# Altium schematic sheet USART.SchDoc
size A4; SheetNumber: 8; SheetTotal: 8
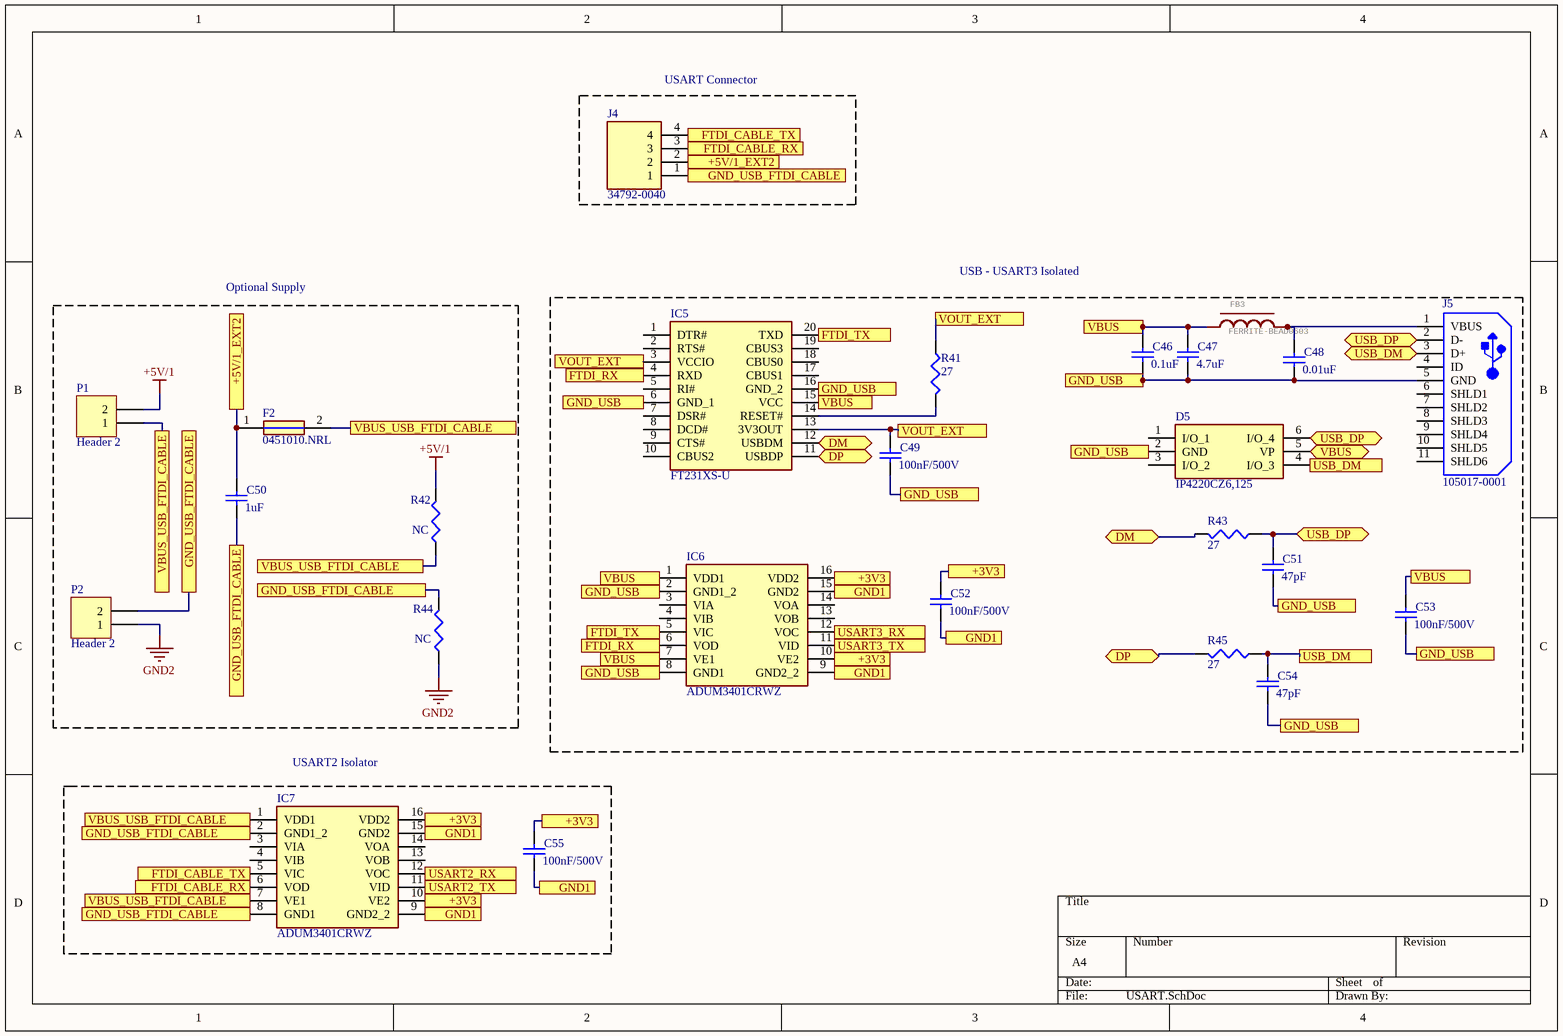
[diagram p0: USART.SchDoc]

## Parts
C46  value 0.1uF  [1608[0603]]  (hidden comment: Cap Semi)
C47  value 4.7uF  [C1206]  (hidden comment: Cap Semi)
C48  value 0.01uF  [1608[0603]]  (hidden comment: Cap Semi)
C49  value 100nF/500V  [1608[0603]]  (hidden comment: Cap Semi)
C50  value 1uF  [1608[0603]]  (hidden comment: Cap Semi)
C51  value 47pF  [1608[0603]]  (hidden comment: Cap Semi)
C52  value 100nF/500V  [1608[0603]]  (hidden comment: Cap Semi)
C53  value 100nF/500V  [1608[0603]]  (hidden comment: Cap Semi)
C54  value 47pF  [1608[0603]]  (hidden comment: Cap Semi)
C55  value 100nF/500V  [1608[0603]]  (hidden comment: Cap Semi)
D5  IP4220CZ6,125  [SOT95P275X110-6N]
F2  0451010.NRL  [FUSC6127X294N]
FB3  FERRITE-BEAD0603  [0603_INCH]
IC5  FT231XS-U  [SOP64P599X175-20N]
IC6  ADUM3401CRWZ  [SOIC127P1032X265-16N]
IC7  ADUM3401CRWZ  [SOIC127P1032X265-16N]
J4  34792-0040  [347920040]
J5  105017-0001  [USB-MICRO-B_V]
P1  Header 2  [HDR1X2]
P2  Header 2  [HDR1X2]
R41  value 27  [J1-0603]  (hidden comment: Res3)
R42  value NC  [J1-0603]  (hidden comment: Res3)
R43  value 27  [J1-0603]  (hidden comment: Res3)
R44  value NC  [J1-0603]  (hidden comment: Res3)
R45  value 27  [J1-0603]  (hidden comment: Res3)

## Blocks framed on the sheet
USART Connector: J4
USB - USART3 Isolated: C46-C49 C51-C54 D5 FB3 IC5 IC6 J5 R41 R43 R45
Optional Supply: C50 F2 P1 P2 R42 R44
USART2 Isolator: C55 IC7

## Ports
+3V3, +5V/1_EXT2, DM (bidir), DP (bidir), FTDI_CABLE_RX (in), FTDI_CABLE_RX (out), FTDI_CABLE_TX (in), FTDI_CABLE_TX (out), FTDI_RX (in), FTDI_RX (out), FTDI_TX (in), FTDI_TX (out), GND1, GND_USB, GND_USB_FTDI_CABLE, USART2_RX (out), USART2_TX (in), USART3_RX (out), USART3_TX (in), USB_DM, USB_DM (bidir), USB_DP (bidir), VBUS, VBUS (bidir), VBUS_USB_FTDI_CABLE, VOUT_EXT

## Nets
+5V/1: P1.2 R42.2
GND2: P2.1 R44.1
+3V3: C52.2 C55.2 IC6.10(VE2) IC6.16(VDD2) IC7.10(VE2) IC7.16(VDD2) ; port +3V3
+5V/1_EXT2: C50.2 F2.1 J4.2 ; port +5V/1_EXT2
DM: IC5.12(USBDM) R43.2 ; port DM
DP: IC5.11(USBDP) R45.2 ; port DP
FTDI_CABLE_RX: IC7.6(VOD) J4.3 ; port FTDI_CABLE_RX
FTDI_CABLE_TX: IC7.5(VIC) J4.4 ; port FTDI_CABLE_TX
FTDI_RX: IC5.4(RXD) IC6.6(VOD) ; port FTDI_RX
FTDI_TX: IC5.20(TXD) IC6.5(VIC) ; port FTDI_TX
GND1: C52.1 C55.1 IC6.9(GND2_2) IC6.15(GND2) IC7.9(GND2_2) IC7.15(GND2) ; port GND1
GND_USB: C46.1 C47.1 C48.1 C49.1 C51.1 C53.1 C54.1 D5.2(GND) IC5.6(GND_1) IC5.16(GND_2) IC6.2(GND1_2) IC6.8(GND1) J5.5(GND) ; port GND_USB
GND_USB_FTDI_CABLE: C50.1 IC7.2(GND1_2) IC7.8(GND1) J4.1 P2.2 R44.2 ; port GND_USB_FTDI_CABLE
USART2_RX: IC7.12(VOC) ; port USART2_RX
USART2_TX: IC7.11(VID) ; port USART2_TX
USART3_RX: IC6.12(VOC) ; port USART3_RX
USART3_TX: IC6.11(VID) ; port USART3_TX
USB_DM: C54.2 D5.4(I/O_3) J5.3(D+) R45.1 ; port USB_DM
USB_DP: C51.2 D5.6(I/O_4) J5.2(D-) R43.1 ; port USB_DP
VBUS: C46.2 C47.2 C53.2 D5.5(VP) FB3.1 IC5.15(VCC) IC6.1(VDD1) IC6.7(VE1) ; port VBUS
VBUS_USB_FTDI_CABLE: F2.2 IC7.1(VDD1) IC7.7(VE1) P1.1 R42.1 ; port VBUS_USB_FTDI_CABLE
VOUT_EXT: C49.2 IC5.3(VCCIO) IC5.13(3V3OUT) R41.1 ; port VOUT_EXT
NetC48_2: C48.2 FB3.2 J5.1(VBUS)
NetIC5_14: IC5.14(RESET#) R41.2

Not connected (* = marked no-connect by the designer): D5 1(I/O_1) 3(I/O_2); IC5 1(DTR#) 2(RTS#) 5(RI#) 7(DSR#) 8(DCD#) 9(CTS#) 10(CBUS2) 17(CBUS1) 18(CBUS0) 19(CBUS3); IC6 3(VIA) 4(VIB) 13(VOB) 14(VOA); IC7 3(VIA) 4(VIB) 13(VOB) 14(VOA); J5 4(ID) 6(SHLD1) 7(SHLD2) 8(SHLD3) 9(SHLD4) 10(SHLD5) 11(SHLD6)

## Library data of the parts
C46-C55 = Cap Semi: Capacitor (Semiconductor SIM Model); Published: 8-Jun-2000; LatestRevisionDate: 29-May-2009; LatestRevisionNote: IPC-7351 Footprint Added.; PackageReference: C1206; Publisher: Altium Limited; PackageDescription: Chip Capacitor
D5 = IP4220CZ6,125: Diode; Manufacturer_Name: Nexperia; Datasheet Link: https://assets.nexperia.com/documents/data-sheet/IP4220CZ6.pdf; Height: 1.1mm; Manufacturer_Part_Number: IP4220CZ6,125; Mouser Part Number: 771-IP4220CZ6-T/R; Mouser Price/Stock: https://www.mouser.co.uk/ProductDetail/Nexperia/IP4220CZ6125?qs=me8TqzrmIYWNWIOv4%2FpxMw%3D%3D; Arrow Part Number: IP4220CZ6,125; Arrow Price/Stock: https://www.arrow.com/en/products/ip4220cz6125/nexperia
F2 = 0451010.NRL: Fuse; Manufacturer_Name: LITTELFUSE; Datasheet Link: http://www.littelfuse.com/~/media/electronics/datasheets/fuses/littelfuse_fuse_451_453_datasheet.pdf.pdf; Height: 2.94mm; Manufacturer_Part_Number: 0451010.NRL; Mouser Part Number: 576-0451010.NRL; Mouser Price/Stock: https://www.mouser.co.uk/ProductDetail/Littelfuse/0451010NRL/?qs=PalBzRKzfnsOVNx2qOnhDw%3D%3D; Arrow Part Number: 0451010.NRL; Arrow Price/Stock: https://www.arrow.com/en/products/0451010.nrl/littelfuse
FB3 = FERRITE-BEAD0603: GateName_1: G$1; SymbolName_1: FBEAD; DeviceName: 0603; LibraryName: COMPAQ; DeviceSetName: FERRITE-BEAD; Package: 0603_INCH
IC5 = FT231XS-U: Integrated Circuit; Manufacturer_Name: FTDI Chip; Datasheet Link: https://www.ftdichip.com/Support/Documents/DataSheets/ICs/DS_FT231X.pdf; Height: 1.753mm; Manufacturer_Part_Number: FT231XS-U; Mouser Part Number: 895-FT231XS-U; Mouser Price/Stock: https://www.mouser.co.uk/ProductDetail/FTDI/FT231XS-U/?qs=Gp1Yz1mis3WFP7tMtj2Z9g%3D%3D; Arrow Part Number: FT231XS-U; Arrow Price/Stock: https://www.arrow.com/en/products/ft231xs-u/ftdi-chip
IC6 IC7 = ADUM3401CRWZ: Integrated Circuit; Manufacturer_Name: Analog Devices; Manufacturer_Part_Number: ADUM3401CRWZ; Mouser Part Number: 584-ADUM3401CRWZ; Mouser Price/Stock: https://www.mouser.co.uk/ProductDetail/Analog-Devices/ADUM3401CRWZ?qs=WIvQP4zGangWcd%252B5oSrqEw%3D%3D; Arrow Part Number: ADUM3401CRWZ; Arrow Price/Stock: https://www.arrow.com/en/products/adum3401crwz/analog-devices
J4 = 34792-0040: Connector; Manufacturer_Name: Molex; Datasheet Link: https://componentsearchengine.com/Datasheets/2/34792-0040.pdf; Height: 14.6mm; Manufacturer_Part_Number: 34792-0040; Mouser Part Number: 538-34792-0040; Mouser Price/Stock: https://www.mouser.co.uk/ProductDetail/Molex/34792-0040?qs=rBzrYveeBvGu5%2FZeCi%2F%252BbA%3D%3D
J5 = CMP-2000-05827-1: Micro-USB B Receptacle, Right Angle, Bottom Mount, Surface Mount, with Solder Tabs, -30 to 85 degC, 5-Pin USB, RoHS, Tape and Reel; Manufacturer: Molex; Featured Product: Micro-USBConnectorsUSBConnectors; Other Names: WM1399DKR; Package Version: Rev. F, 12/2012; Number of Contacts: 5; Connector Type: USB-microB; Catalog Drawings: 1050170001; 3D Model: 105017-0001.stp; Mating Products: WM17145-ND-CABLEMICROUSBBTOSTDA1.0MWM17147-ND-CABLEMICROUSBBTOSTDA2.0MWM17146-ND-CABLEMICROUSBBTOSTDA1.5M; PCN Assembly/Origin: ResinSupplier21/Oct/2015; Voltage - Max: 30V; Online Catalog: Molex-MicroUSB; Manufacturer URL: http://www.molex.com/; Package Description: 5-Leads USB, Micro B, Body 7.5 x 5 mm, Pitch 0.65 mm; Datasheet URL: http://www.molex.com/elqNow/elqRedir.htm?ref=http://www.molex.com/webdocs/datasheets/pdf/en-us/1050170001_IO_CONNECTORS.pdf; Ingress Protection: -; Datasheet Version: 03/2016; Mounting Type: BoardCutout,SurfaceMount,RightAngle; Circuits: 5; Standard Package: 1; Package Reference: MICRO-B; Package URL: http://www.molex.com/pdm_docs/sd/1050170001_sd.pdf; Category: Connectors,Interconnects; Series: -; RoHS Information: 1050170001CertofCompliance; Features: Shielded,SolderRetention; Family: USB,DVI,HDMIConnectors; Specifications: -; Gender: Receptacle; Packaging: Digi-Reel®; Mounting Technology: SurfaceMount
P1 P2 = Header 2: Header, 2-Pin; LatestRevisionDate: 17-Jul-2002; LatestRevisionNote: Re-released for DXP Platform.; Publisher: Altium Limited
R41-R45 = Res3: Resistor; Published: 8-Jun-2000; LatestRevisionDate: 29-May-2009; LatestRevisionNote: IPC-7351 Footprint Added.; PackageReference: J1-0603; Publisher: Altium Limited; PackageDescription: Chip Resistor